# EAGLE board design (EAGLE 7.7.0), part 1 of 3
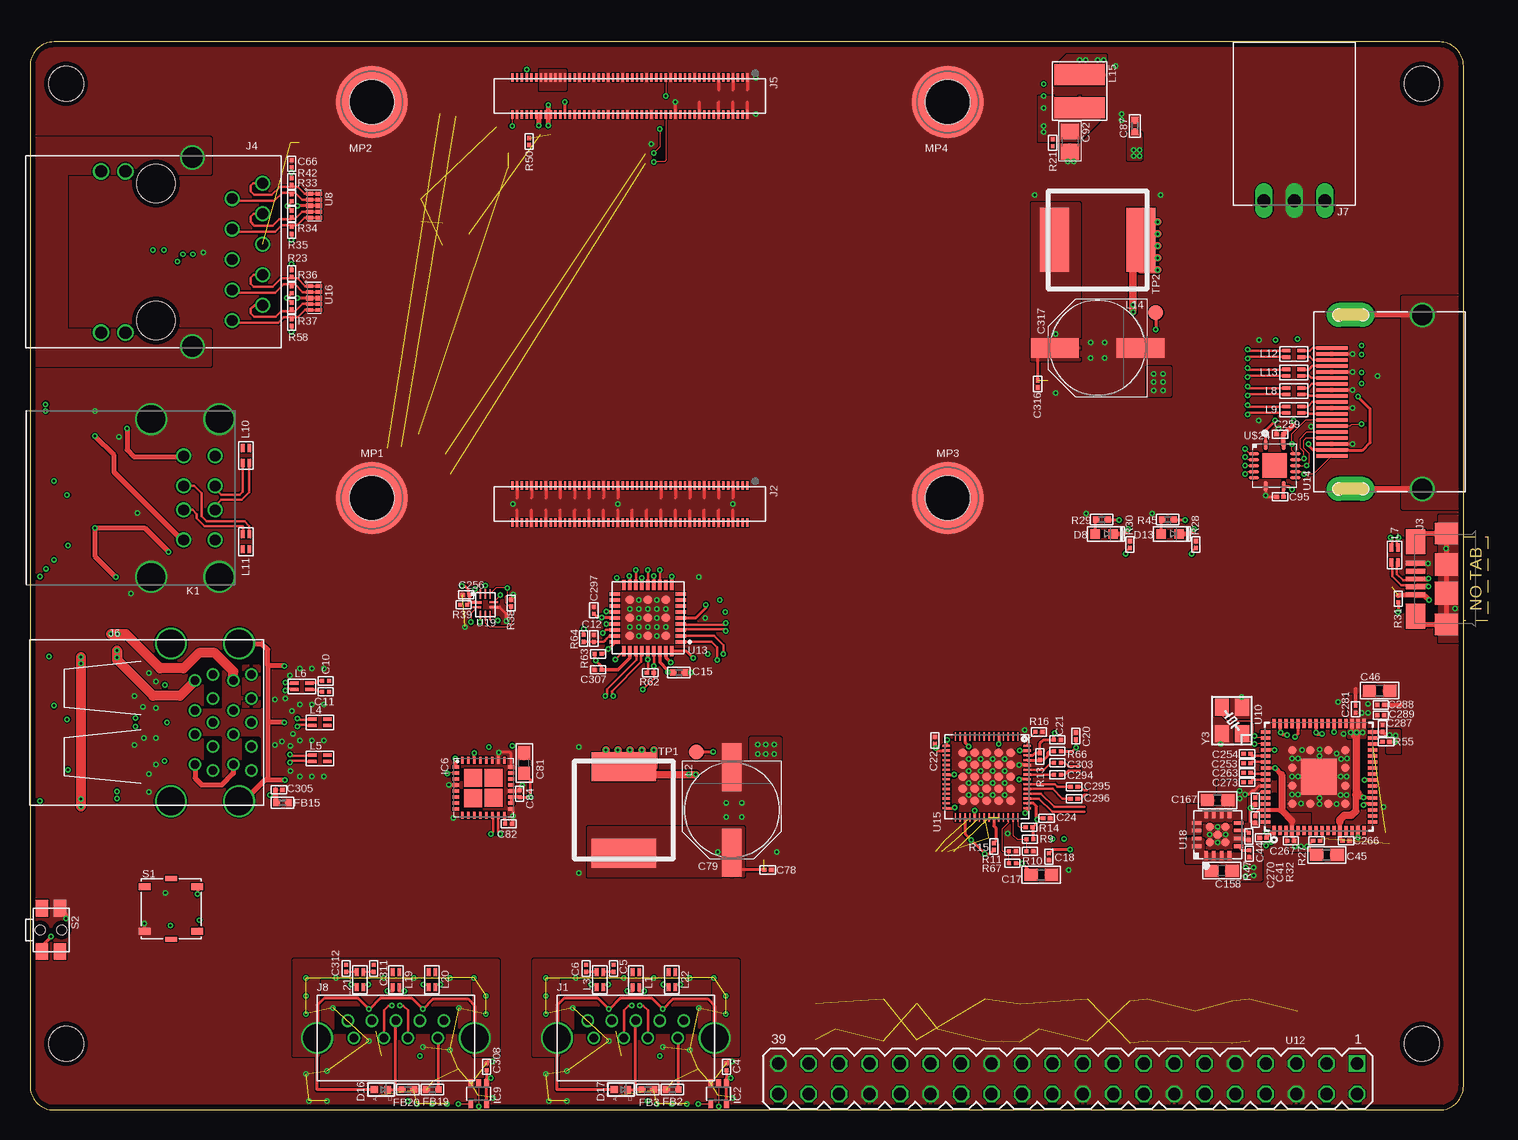
[diagram p24: board, top side]
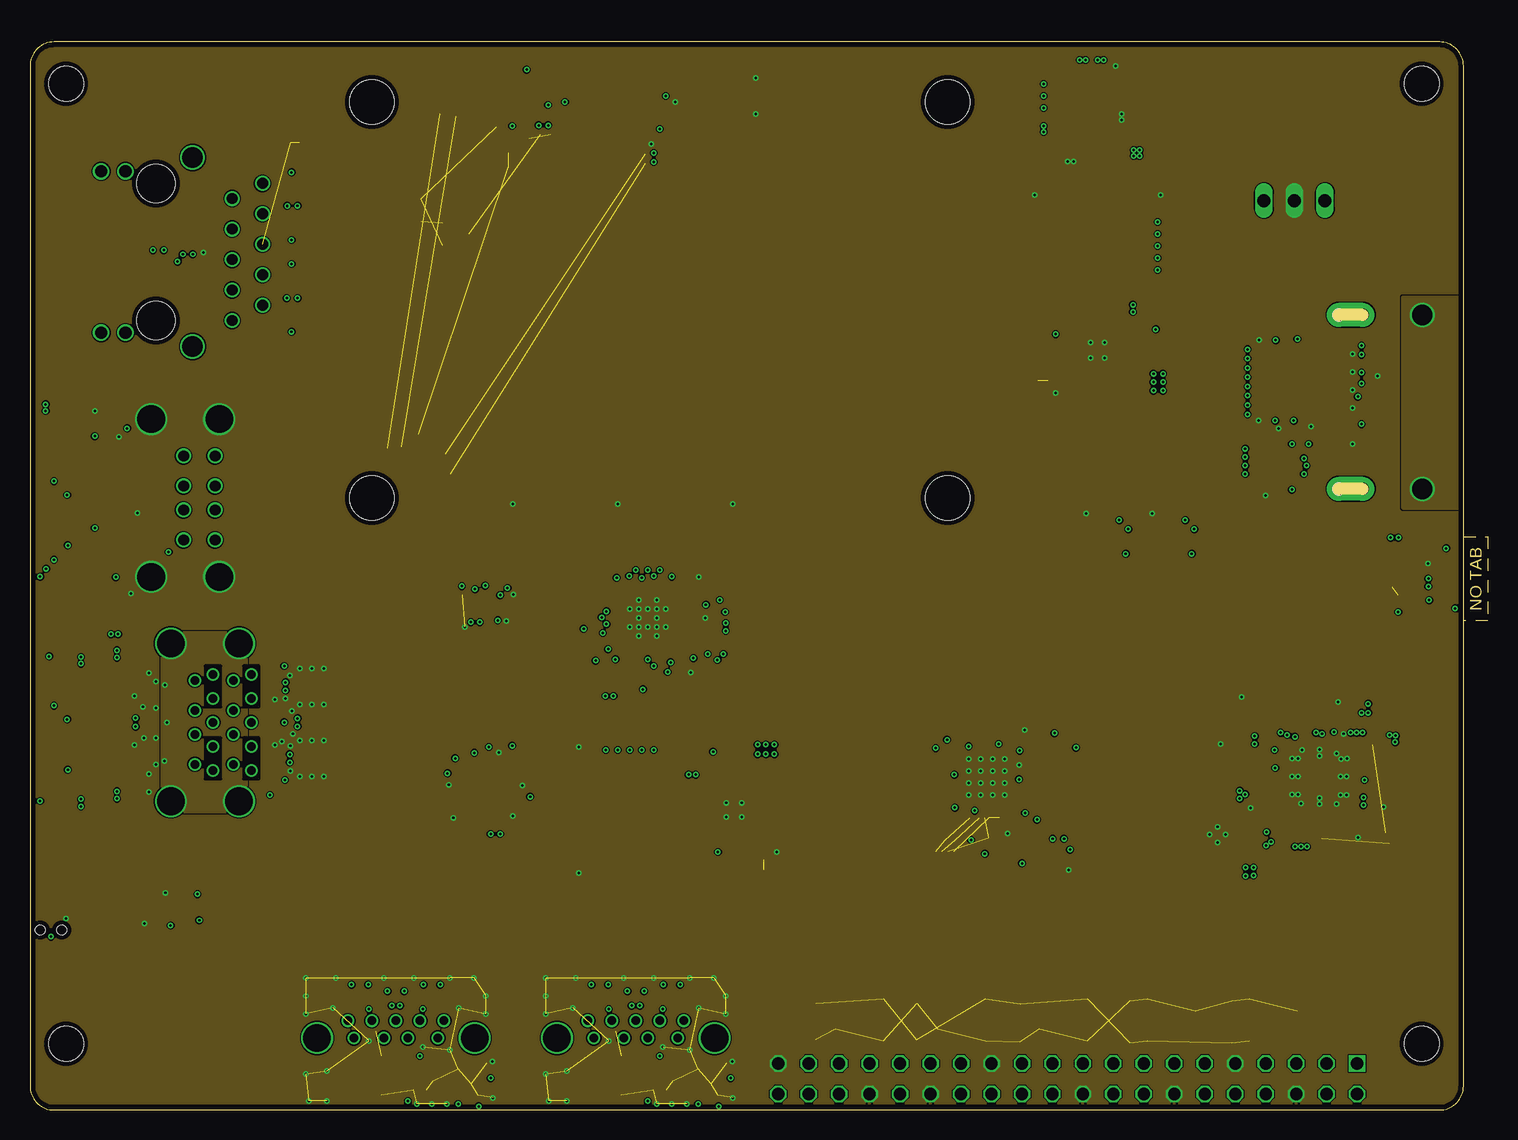
[diagram p25: board, inner layer GND]
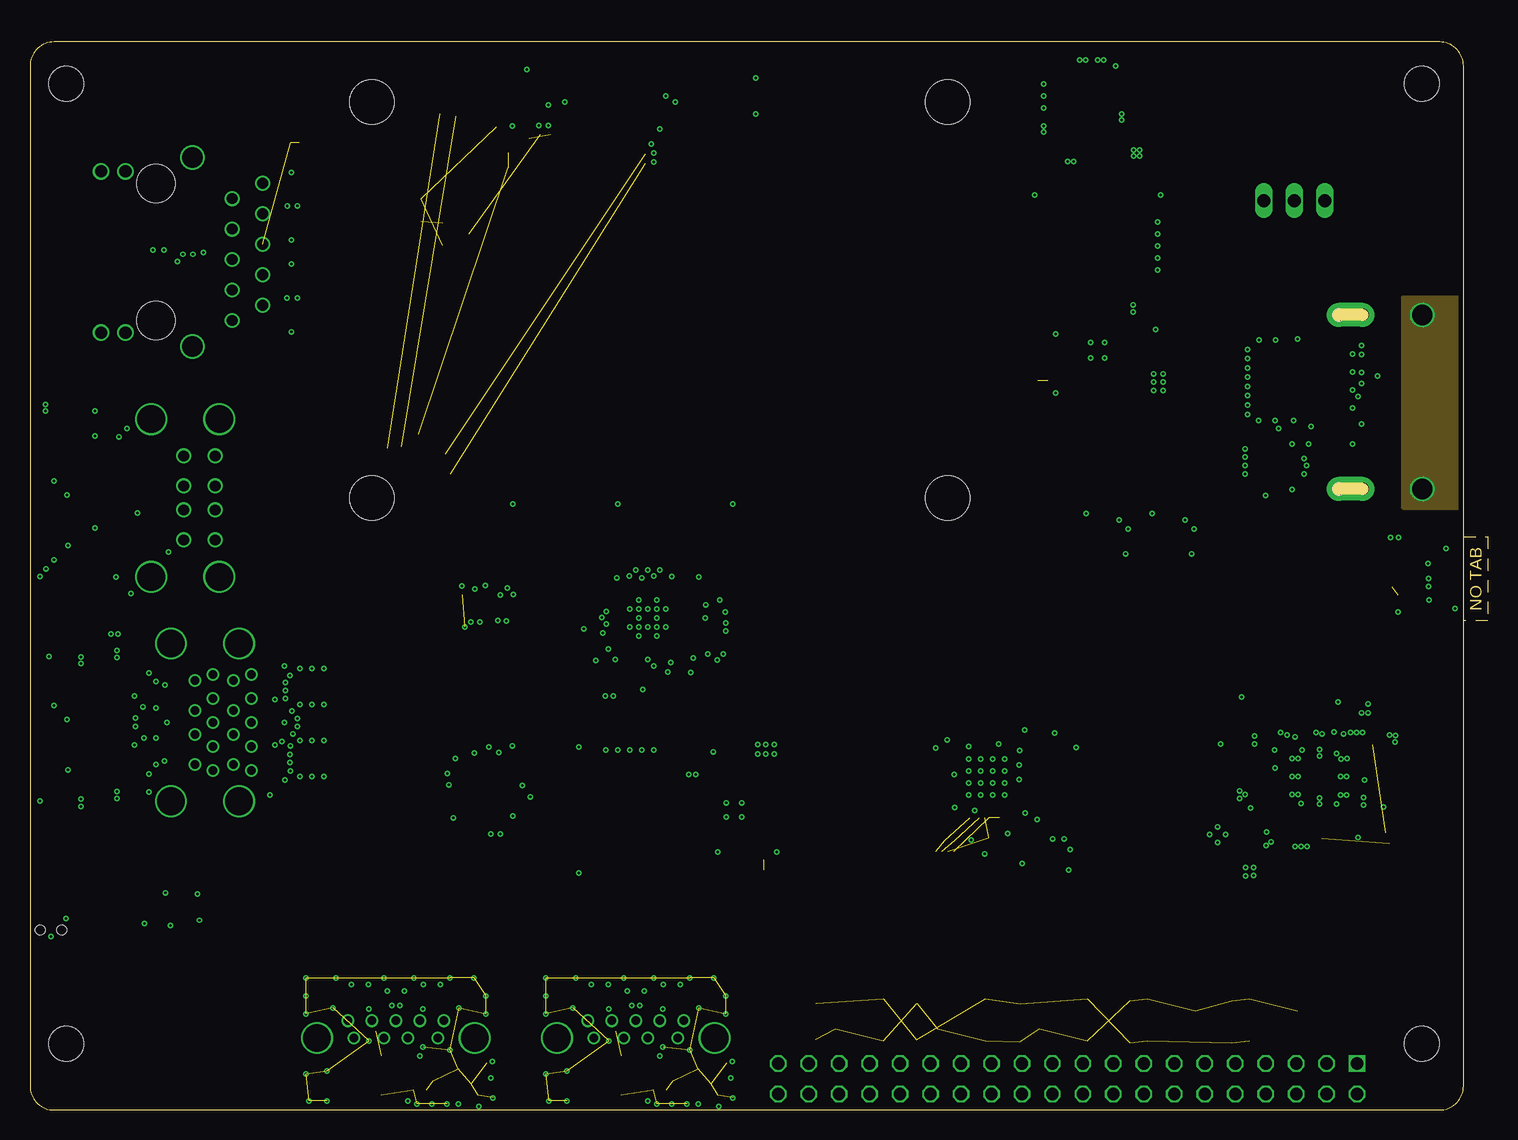
[diagram p26: board, inner layer S3]
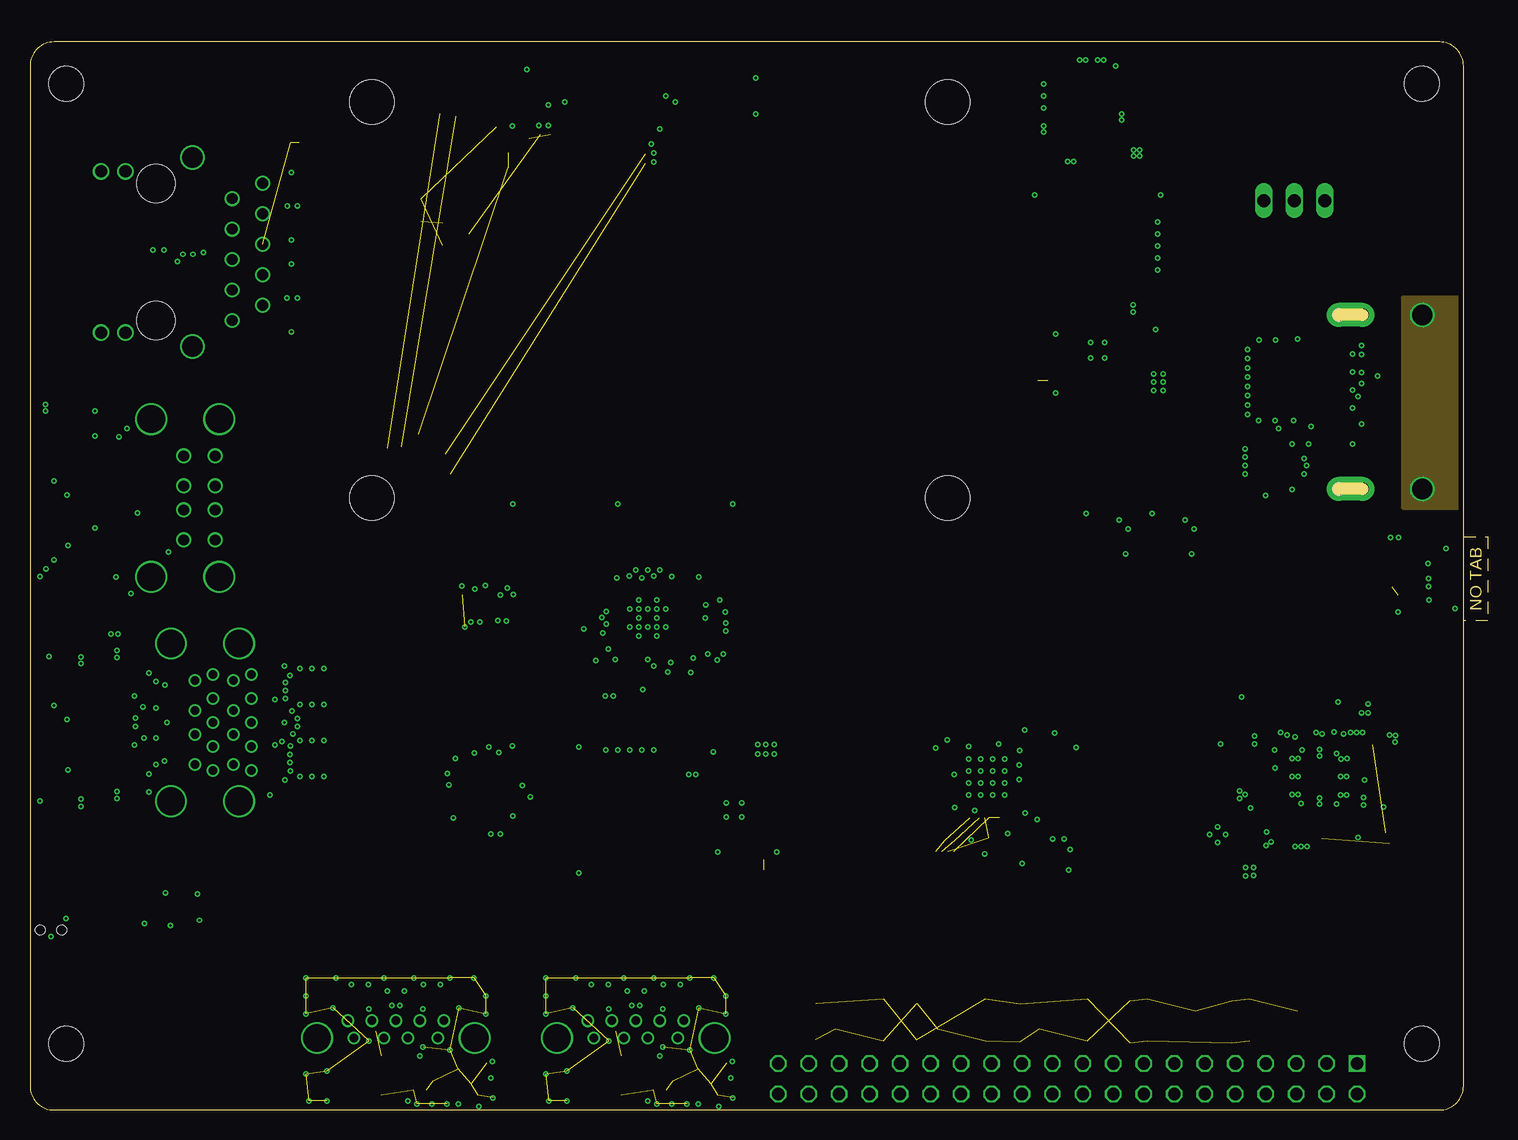
[diagram p27: board, inner layer S14]
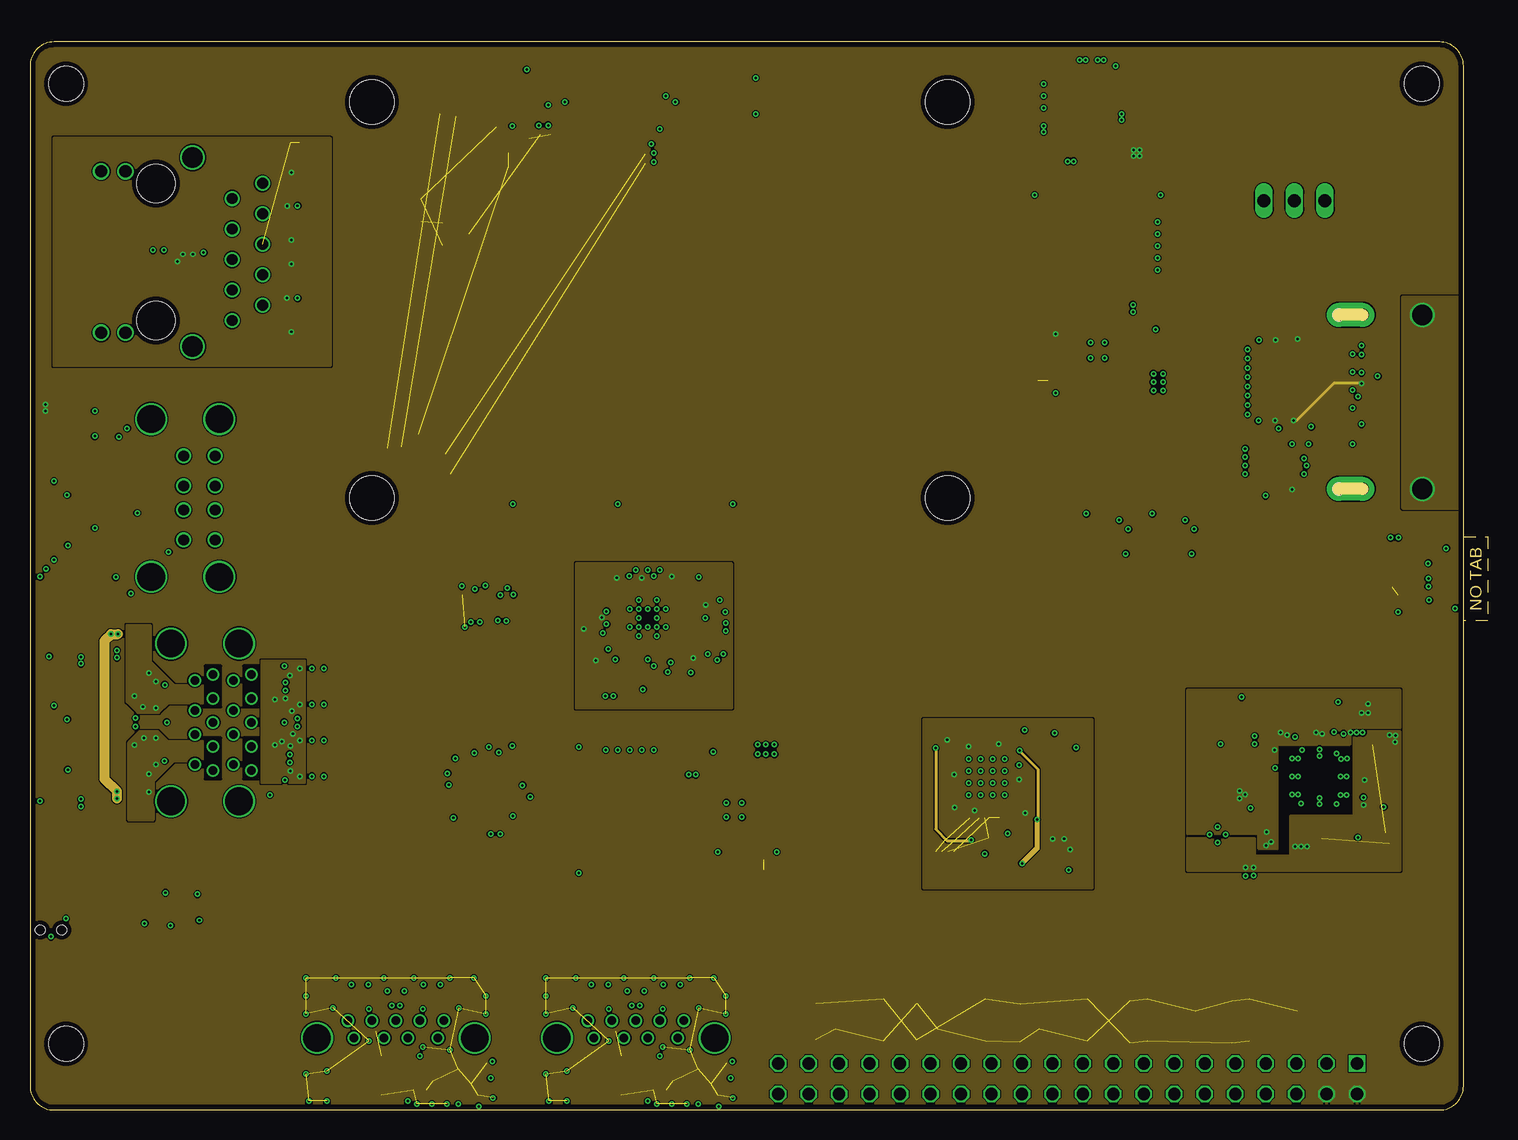
[diagram p28: board, inner layer Power]
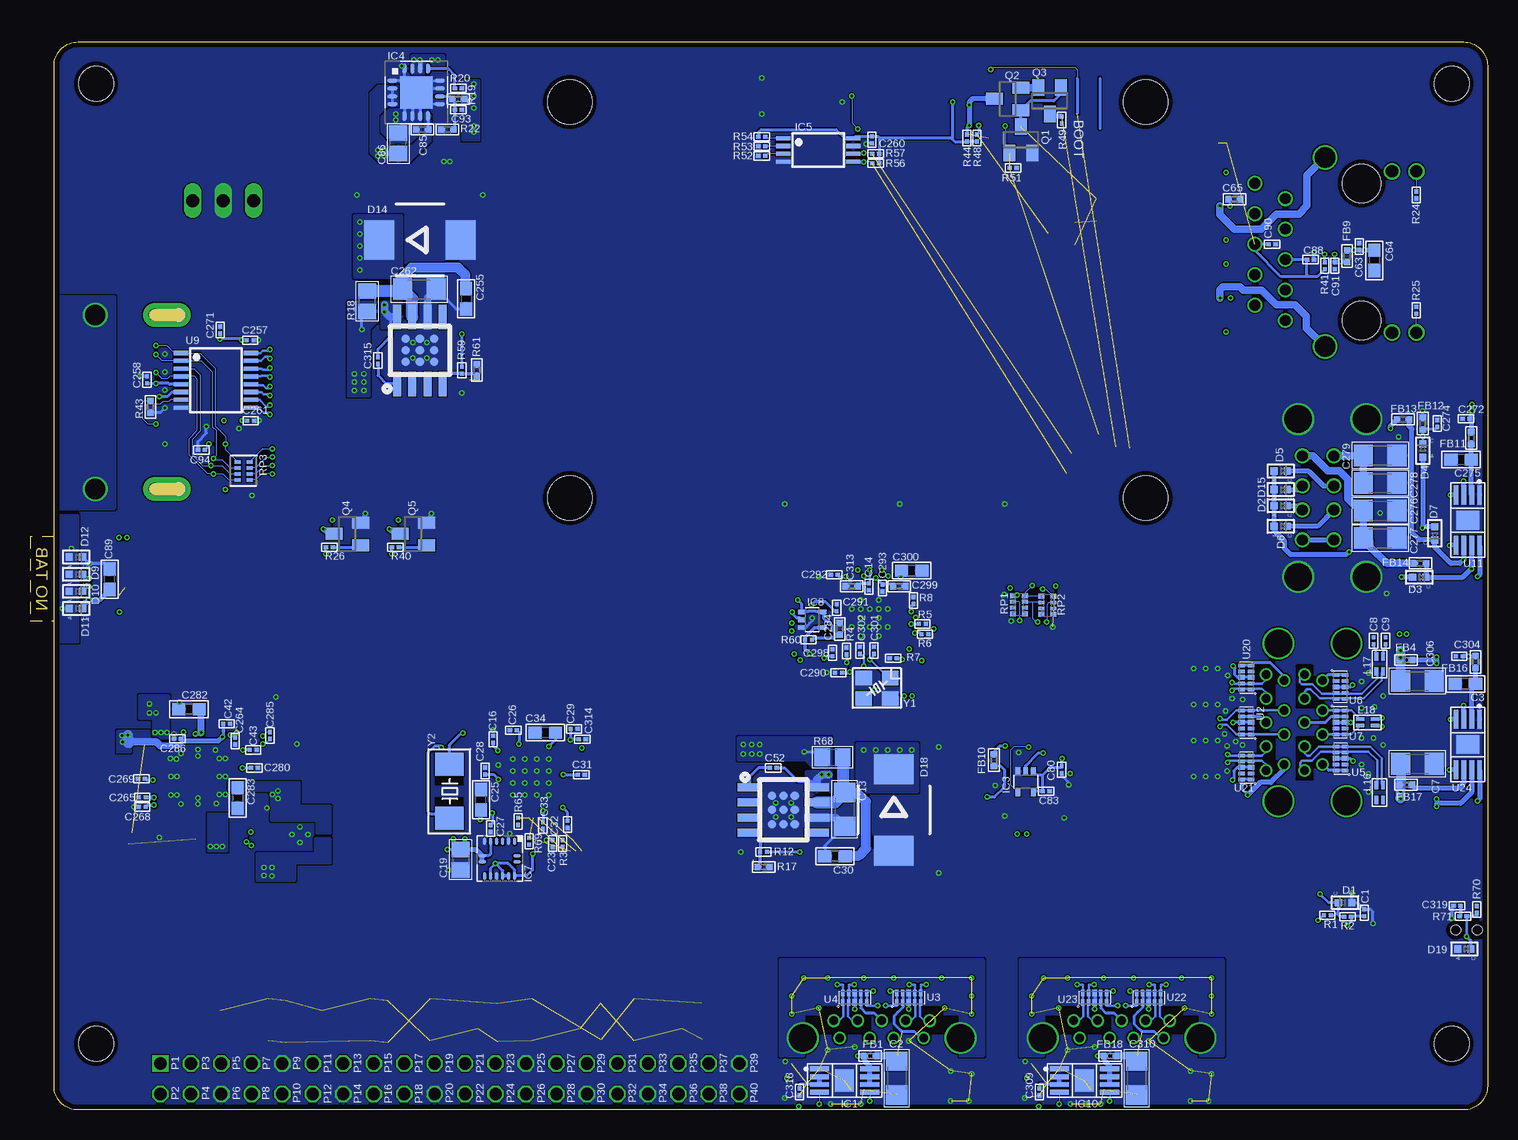
[diagram p29: board, bottom side, seen from below]

Size 121.5 x 89 mm. Coordinates in mm from the lower left corner, seen from the top.
Outline: 119.5,47.75 121.5,47.75 121.5,40.75 119.5,40.75
Outline: 2,0 117.5,0 arc90 119.5,2 119.5,87 arc90 117.5,89 2,89 arc90 0,87 0,2 arc90 2,0
Copper layers (1+2*3+14*15+16): Top 0.035mm / dielectric 0.2mm / GND 0.035mm / dielectric 0.2mm / S3 0.035mm / dielectric 0.2mm / S14 0.035mm / dielectric 0.2mm / Power 0.035mm / dielectric 0.2mm / Bottom 0.035mm
Design rules "geppetto": minimum track width 4mil, minimum drill 8mil, track to track 4mil, track to pad 0.15mm, pad to pad 0.15mm, via to via 0.15mm, smd to smd 0mil, copper to edge 15mil, drill to drill 10mil, minimum pad ring 7mil, minimum via ring 5mil, stop-mask expansion 3mil, vias tented up to drill 20mil, thermal gap 0mil
Net classes: 1 supply: width 0.254 mm; 2 analog: width 0.178 mm; 5 USB: width 0.2 mm, clearance 0.2 mm; 6 HDMI: width 0.2 mm, clearance 0.3 mm; 7 50_OHM: width 0.378 mm, clearance 0.3 mm; 4 xxwide: width 0.203 mm
vRestrict: area 84.5,79 to 94,88.5

## Footprints (pad centres in the part's own frame; a part is rotated, then mirrored left to right if it is on the bottom)
0201 = smd 0.356 x 0.33: 1 -0.292,0; 2 0.292,0
1206 = smd 1.6 x 1.8: 1 -1.4,0; 2 1.4,0
0603 = smd 1.1 x 1: 1 -0.85,0; 2 0.85,0
0402 = smd 0.559 x 0.559: 1 -0.483,0; 2 0.483,0
0805 = smd 1.3 x 1.5: 1 -0.85,0; 2 0.85,0
PANASONIC_F = smd 4 x 1.6: + 3.55,0; - -3.55,0
D0402 = smd 0.6 x 0.6: P1 0,-0.55; P2 0,0.55
D0603 = smd 0.8 x 0.8: A -0.75,0; C 0.75,0
DO-214AB = smd 2.5 x 3.3: A 3.4,0; C -3.4,0
MSOP8-PAD = smd 0.4 x 1.6: 1 -0.975,-2.1; 2 -0.325,-2.1; 3 0.325,-2.1; 4 0.975,-2.1; 5 0.975,2.1; 6 0.325,2.1; 7 -0.325,2.1; 8 -0.975,2.1 | smd 1.89 x 1.57: TP 0,0
SC70-5 = smd 0.4 x 0.7: 1 -0.65,-0.85; 2 0,-0.85; 3 0.65,-0.85; 4 0.65,0.85; 5 -0.65,0.85
PQFP16 = smd 0.85 x 0.35: 1 -1.975,0.975; 2 -1.975,0.325; 3 -1.975,-0.325; 4 -1.975,-0.975; 9 1.975,-0.975; 10 1.975,-0.325; 11 1.975,0.325; 12 1.975,0.975 | smd 0.35 x 0.85: 5 -0.975,-1.975; 6 -0.325,-1.975; 7 0.325,-1.975; 8 0.975,-1.975; 13 0.975,1.975; 14 0.325,1.975; 15 -0.325,1.975; 16 -0.975,1.975 | smd 2.7 x 2.7: P$1 0,0
TSSOP8 = smd 0.35 x 1.2: 1 -0.975,-2.925; 2 -0.325,-2.925; 3 0.325,-2.925; 4 0.975,-2.925; 5 0.975,2.925; 6 0.325,2.925; 7 -0.325,2.925; 8 -0.975,2.925
QFN32 = smd 0.6 x 0.3: 1 -2.3,1.75; 2 -2.3,1.25; 3 -2.3,0.75; 4 -2.3,0.25; 5 -2.3,-0.25; 6 -2.3,-0.75; 7 -2.3,-1.25; 8 -2.3,-1.75; 17 2.3,-1.75; 18 2.3,-1.25; 19 2.3,-0.75; 20 2.3,-0.25; 21 2.3,0.25; 22 2.3,0.75; 23 2.3,1.25; 24 2.3,1.75 | smd 0.3 x 0.6: 9 -1.75,-2.3; 10 -1.25,-2.3; 11 -0.75,-2.3; 12 -0.25,-2.3; 13 0.25,-2.3; 14 0.75,-2.3; 15 1.25,-2.3; 16 1.75,-2.3; 25 1.75,2.3; 26 1.25,2.3; 27 0.75,2.3; 28 0.25,2.3; 29 -0.25,2.3; 30 -0.75,2.3; 31 -1.25,2.3; 32 -1.75,2.3 | smd 1.5 x 1.5: EXP1 -0.85,0.85; EXP2 0.85,0.85; EXP3 -0.85,-0.86; EXP4 0.85,-0.85
EP-3X3MMQFN16 = smd 0.65 x 0.3: 1 -1.45,1.25; 2 -1.45,0.75; 3 -1.45,0.25; 4 -1.45,-0.25; 5 -1.45,-0.75; 6 -1.45,-1.25; 9 1.45,-1.25; 10 1.45,-0.75; 11 1.45,-0.25; 12 1.45,0.25; 13 1.45,0.75; 14 1.45,1.25 | smd 0.3 x 0.65: 7 -0.25,-1.45; 8 0.25,-1.45; 15 0.25,1.45; 16 -0.25,1.45
USB3-A-H-VERT = drill 0.7 round: D+ 0,-1; D- 0,1; DRAIN 1.44,0; GND 0,-3.5; SSRX+ 1.44,-2; SSRX- 1.44,-4; SSTX+ 1.44,4; SSTX- 1.44,2; VBUS 0,3.5 | drill 2.3 round: SH1 0,6.57; SH2 0,-6.57
HRS_DF40C-100DS-0.4V(51) = smd 0.2 x 0.7: 1 -9.8,-1.54; 2 -9.8,1.54; 3 -9.4,-1.54; 4 -9.4,1.54; 5 -9,-1.54; 6 -9,1.54; 7 -8.6,-1.54; 8 -8.6,1.54; 9 -8.2,-1.54; 10 -8.2,1.54; 11 -7.8,-1.54; 12 -7.8,1.54; 13 -7.4,-1.54; 14 -7.4,1.54; 15 -7,-1.54; 16 -7,1.54; 17 -6.6,-1.54; 18 -6.6,1.54; 19 -6.2,-1.54; 20 -6.2,1.54; 21 -5.8,-1.54; 22 -5.8,1.54; 23 -5.4,-1.54; 24 -5.4,1.54; 25 -5,-1.54; 26 -5,1.54; 27 -4.6,-1.54; 28 -4.6,1.54; 29 -4.2,-1.54; 30 -4.2,1.54; 31 -3.8,-1.54; 32 -3.8,1.54; 33 -3.4,-1.54; 34 -3.4,1.54; 35 -3,-1.54; 36 -3,1.54; 37 -2.6,-1.54; 38 -2.6,1.54; 39 -2.2,-1.54; 40 -2.2,1.54; 41 -1.8,-1.54; 42 -1.8,1.54; 43 -1.4,-1.54; 44 -1.4,1.54; 45 -1,-1.54; 46 -1,1.54; 47 -0.6,-1.54; 48 -0.6,1.54; 49 -0.2,-1.54; 50 -0.2,1.54; 51 0.2,-1.54; 52 0.2,1.54; 53 0.6,-1.54; 54 0.6,1.54; 55 1,-1.54; 56 1,1.54; 57 1.4,-1.54; 58 1.4,1.54; 59 1.8,-1.54; 60 1.8,1.54; 61 2.2,-1.54; 62 2.2,1.54; 63 2.6,-1.54; 64 2.6,1.54; 65 3,-1.54; 66 3,1.54; 67 3.4,-1.54; 68 3.4,1.54; 69 3.8,-1.54; 70 3.8,1.54; 71 4.2,-1.54; 72 4.2,1.54; 73 4.6,-1.54; 74 4.6,1.54; 75 5,-1.54; 76 5,1.54; 77 5.4,-1.54; 78 5.4,1.54; 79 5.8,-1.54; 80 5.8,1.54; 81 6.2,-1.54; 82 6.2,1.54; 83 6.6,-1.54; 84 6.6,1.54; 85 7,-1.54; 86 7,1.54; 87 7.4,-1.54; 88 7.4,1.54; 89 7.8,-1.54; 90 7.8,1.54; 91 8.2,-1.54; 92 8.2,1.54; 93 8.6,-1.54; 94 8.6,1.54; 95 9,-1.54; 96 9,1.54; 97 9.4,-1.54; 98 9.4,1.54; 99 9.8,-1.54; 100 9.8,1.54
USB_MICRO_B = smd 2.1 x 1.6: COMMON_SHEILD1 -3.1,4; COMMON_SHEILD2 3.1,4 | smd 1.8 x 1.9: COMMON_SHEILD3 -3.8,1.45; COMMON_SHEILD6 3.8,1.45 | smd 1.9 x 1.9: COMMON_SHEILD4 -1.2,1.45; COMMON_SHEILD5 1.2,1.45 | smd 0.4 x 1.6: P1 -1.3,4; P2 -0.65,4; P3 0,4; P4 0.65,4; P5 1.3,4
7499111447 = drill 0.89 round: 1 5.72,-8.89; 2 4.45,-6.35; 3 3.18,-8.89; 4 1.91,-6.35; 5 0.64,-8.89; 6 -0.63,-6.35; 7 -1.9,-8.89; 8 -3.17,-6.35; 9 -4.44,-8.89; 10 -5.71,-6.35 | drill 1.02 round: 11 6.725,2.54; 12 6.725,4.57; 13 -6.725,2.54; 14 -6.725,4.57 | drill 1.7 round: 15 -7.875,-3.05; 16 7.875,-3.05 | hole 3.2: 5.715,0; -5.715,0
USB3-A-H-DUAL = drill 0.7 round: 1 2,3.5; 2 2,1; 3 2,-1; 4 2,-3.5; 5 3.5,-4; 6 3.5,-2; 7 3.5,0; 8 3.5,2; 9 3.5,4; 10 5.2,3.5; 11 5.2,1; 12 5.2,-1; 13 5.2,-3.5; 14 6.7,-4; 15 6.7,-2; 16 6.7,0; 17 6.7,2; 18 6.7,4 | drill 2.3 round: S1 0,6.57; S2 0,-6.57; S3 5.68,6.57; S4 5.68,-6.57
1X03_90_TH_SHROUD = drill 1.09 long: 1 -2.54,-6.415; 2 0,-6.415; 3 2.54,-6.415
61400826021 = drill 2.3 round: 5 -6.57,5.68; 6 -6.57,0; 7 6.57,0; 8 6.57,5.68 | drill 0.9 round: A1 -3.5,5.33; A2 -1,5.33; A3 1,5.33; A4 3.5,5.33; B1 -3.5,2.71; B2 -1,2.71; B3 1,2.71; B4 3.5,2.71
0504-DLP11S = smd 0.7 x 0.3: 1 -0.625,0.275; 2 0.625,0.275; 3 0.625,-0.275; 4 -0.625,-0.275
3232DZ = smd 2.413 x 5.334: 1 -3.619,0; 2 3.619,0
1515 = smd 1.75 x 4.2: 1 -1.375,0; 2 1.375,0
WA-SMSI_9774___151 = smd 6 x 6: 1 0,0 | hole 3.7: 0,0
SOT23 = smd 1 x 1.4: 1 -0.95,-1.1; 2 0.95,-1.1; 3 0,1.1
RP741X083 = smd 0.4 x 0.5: 1 -0.75,-0.5; 4 0.75,-0.5; 5 0.75,0.5; 8 -0.75,0.5 | smd 0.3 x 0.5: 2 -0.25,-0.5; 3 0.25,-0.5; 6 0.25,0.5; 7 -0.25,0.5
741X08 = smd 0.3 x 0.5: 1 -0.75,-0.5; 2 -0.25,-0.5; 3 0.25,-0.5; 4 0.75,-0.5; 5 0.75,0.5; 6 0.25,0.5; 7 -0.25,0.5; 8 -0.75,0.5
EVQ = smd 0.6 x 1: A@1 -1.85,2.2; A@2 -1.85,-2.2; B@1 1.85,2.2; B@2 1.85,-2.2 | smd 0.45 x 1: G@1 -2.525,0; G@2 2.525,0
EVQP-4 = smd 1.4 x 1.05: A@1 -1.8,0.75; A@2 1.8,0.75; B@1 -1.8,-0.75; B@2 1.8,-0.75 | hole 0.8: 0,0.9; 0,-0.9
TP0500 = smd 1.27 x 1.27: 1 0,0
8SO_POWERPAD = smd 2.05 x 0.66: 1 -2.79,1.905; 2 -2.79,0.635; 3 -2.79,-0.635; 4 -2.79,-1.905; 5 2.79,-1.905; 6 2.79,-0.635; 7 2.79,0.635; 8 2.79,1.905 | smd 0.7 x 0.7: 9 0,0; PWRPAD1 -0.95,1.2; PWRPAD2 0,1.2; PWRPAD3 0.95,1.2; PWRPAD4 -0.95,0; PWRPAD5 0.95,0; PWRPAD6 -0.95,-1.2; PWRPAD7 0,-1.2; PWRPAD8 0.95,-1.2
UFDFN-10 = smd 0.3 x 0.55: 1 -1,-0.385; 2 -0.5,-0.385; 4 0.5,-0.385; 5 1,-0.385; 6 1,0.385; 7 0.5,0.385; 9 -0.5,0.385; 10 -1,0.385 | smd 0.4 x 0.55: 3 0,-0.385; 8 0,0.385
TSSOP16 = smd 1.2 x 0.35: 1 -2.925,2.275; 2 -2.925,1.625; 3 -2.925,0.975; 4 -2.925,0.325; 5 -2.925,-0.325; 6 -2.925,-0.975; 7 -2.925,-1.625; 8 -2.925,-2.275; 9 2.925,-2.275; 10 2.925,-1.625; 11 2.925,-0.975; 12 2.925,-0.325; 13 2.925,0.325; 14 2.925,0.975; 15 2.925,1.625; 16 2.925,2.275
QFN64-9X9MM-FT2232HQ = smd 0.8 x 0.3: 1 -4.45,3.75; 2 -4.45,3.25; 3 -4.45,2.75; 4 -4.45,2.25; 5 -4.45,1.75; 6 -4.45,1.25; 7 -4.45,0.75; 8 -4.45,0.25; 9 -4.45,-0.25; 10 -4.45,-0.75; 11 -4.45,-1.25; 12 -4.45,-1.75; 13 -4.45,-2.25; 14 -4.45,-2.75; 15 -4.45,-3.25; 16 -4.45,-3.75; 33 4.45,-3.75; 34 4.45,-3.25; 35 4.45,-2.75; 36 4.45,-2.25; 37 4.45,-1.75; 38 4.45,-1.25; 39 4.45,-0.75; 40 4.45,-0.25; 41 4.45,0.25; 42 4.45,0.75; 43 4.45,1.25; 44 4.45,1.75; 45 4.45,2.25; 46 4.45,2.75; 47 4.45,3.25; 48 4.45,3.75 | smd 0.3 x 0.8: 17 -3.75,-4.45; 18 -3.25,-4.45; 19 -2.75,-4.45; 20 -2.25,-4.45; 21 -1.75,-4.45; 22 -1.25,-4.45; 23 -0.75,-4.45; 24 -0.25,-4.45; 25 0.25,-4.45; 26 0.75,-4.45; 27 1.25,-4.45; 28 1.75,-4.45; 29 2.25,-4.45; 30 2.75,-4.45; 31 3.25,-4.45; 32 3.75,-4.45; 49 3.75,4.45; 50 3.25,4.45; 51 2.75,4.45; 52 2.25,4.45; 53 1.75,4.45; 54 1.25,4.45; 55 0.75,4.45; 56 0.25,4.45; 57 -0.25,4.45; 58 -0.75,4.45; 59 -1.25,4.45; 60 -1.75,4.45; 61 -2.25,4.45; 62 -2.75,4.45; 63 -3.25,4.45; 64 -3.75,4.45 | smd 3 x 3: 65 0,0 | smd 0.7 x 0.7: EPAD1 -2.22,2.21; EPAD2 -0.72,2.21; EPAD3 0.78,2.21; EPAD4 2.22,2.21; EPAD5 -2.22,0.71; EPAD6 -2.22,-0.79; EPAD7 -2.22,-2.21; EPAD8 -0.72,-2.21; EPAD9 0.78,-2.21; EPAD10 2.22,-2.21; EPAD11 2.22,-0.79; EPAD12 2.22,0.71
2X20 = drill 1.016 square: 1 24.13,1.27 | drill 1.016 octagon: 2 24.13,-1.27; 3 21.59,1.27; 4 21.59,-1.27; 5 19.05,1.27; 6 19.05,-1.27; 7 16.51,1.27; 8 16.51,-1.27; 9 13.97,1.27; 10 13.97,-1.27; 11 11.43,1.27; 12 11.43,-1.27; 13 8.89,1.27; 14 8.89,-1.27; 15 6.35,1.27; 16 6.35,-1.27; 17 3.81,1.27; 18 3.81,-1.27; 19 1.27,1.27; 20 1.27,-1.27; 21 -1.27,1.27; 22 -1.27,-1.27; 23 -3.81,1.27; 24 -3.81,-1.27; 25 -6.35,1.27; 26 -6.35,-1.27; 27 -8.89,1.27; 28 -8.89,-1.27; 29 -11.43,1.27; 30 -11.43,-1.27; 31 -13.97,1.27; 32 -13.97,-1.27; 33 -16.51,1.27; 34 -16.51,-1.27; 35 -19.05,1.27; 36 -19.05,-1.27; 37 -21.59,1.27; 38 -21.59,-1.27; 39 -24.13,1.27; 40 -24.13,-1.27
QFN36-6X6MM = smd 0.9 x 0.28: 1 -2.75,2; 2 -2.75,1.5; 3 -2.75,1; 4 -2.75,0.5; 5 -2.75,0; 6 -2.75,-0.5; 7 -2.75,-1; 8 -2.75,-1.5; 9 -2.75,-2; 19 2.75,-2; 20 2.75,-1.5; 21 2.75,-1; 22 2.75,-0.5; 23 2.75,0; 24 2.75,0.5; 25 2.75,1; 26 2.75,1.5; 27 2.75,2 | smd 0.28 x 0.9: 10 -2,-2.75; 11 -1.5,-2.75; 12 -1,-2.75; 13 -0.5,-2.75; 14 0,-2.75; 15 0.5,-2.75; 16 1,-2.75; 17 1.5,-2.75; 18 2,-2.75; 28 2,2.75; 29 1.5,2.75; 30 1,2.75; 31 0.5,2.75; 32 0,2.75; 33 -0.5,2.75; 34 -1,2.75; 35 -1.5,2.75; 36 -2,2.75 | smd 0.7 x 0.7: EPAD 0,0; EXP1 1.5,0; EXP2 -1.5,0; EXP3 0,1.5; EXP4 0,-1.5; EXP5 1.5,-1.5; EXP6 -1.5,-1.5; EXP7 -1.5,1.5; EXP8 1.5,1.5
47151-001 = smd 0.3 x 2.6: 1 4.5,1.56; 2 4,1.56; 3 3.5,1.56; 4 3,1.56; 5 2.5,1.56; 6 2,1.56; 7 1.5,1.56; 8 1,1.56; 9 0.5,1.56; 10 0,1.56; 11 -0.5,1.56; 12 -1,1.56; 13 -1.5,1.56; 14 -2,1.56; 15 -2.5,1.56; 16 -3,1.56; 17 -3.5,1.56; 18 -4,1.56; 19 -4.5,1.56 | drill 1.7 round: G1 -7.25,-5.96; G2 7.25,-5.96 | drill 1 pad 2 offset: G3 7.25,-1; G4 -7.25,-1 | hole 1: -7.25,1; 7.25,1
VQFN56 = smd 0.75 x 0.2: 1 -3.38,2.6; 2 -3.38,2.2; 3 -3.38,1.8; 4 -3.38,1.4; 5 -3.38,1; 6 -3.38,0.6; 7 -3.38,0.2; 8 -3.38,-0.2; 9 -3.38,-0.6; 10 -3.38,-1; 11 -3.38,-1.4; 12 -3.38,-1.8; 13 -3.38,-2.2; 14 -3.38,-2.6; 29 3.38,-2.6; 30 3.38,-2.2; 31 3.38,-1.8; 32 3.38,-1.4; 33 3.38,-1; 34 3.38,-0.6; 35 3.38,-0.2; 36 3.38,0.2; 37 3.38,0.6; 38 3.38,1; 39 3.38,1.4; 40 3.38,1.8; 41 3.38,2.2; 42 3.38,2.6 | smd 0.2 x 0.75: 15 -2.6,-3.38; 16 -2.2,-3.38; 17 -1.8,-3.38; 18 -1.4,-3.38; 19 -1,-3.38; 20 -0.6,-3.38; 21 -0.2,-3.38; 22 0.2,-3.38; 23 0.6,-3.38; 24 1,-3.38; 25 1.4,-3.38; 26 1.8,-3.38; 27 2.2,-3.38; 28 2.6,-3.38; 43 2.6,3.38; 44 2.2,3.38; 45 1.8,3.38; 46 1.4,3.38; 47 1,3.38; 48 0.6,3.38; 49 0.2,3.38; 50 -0.2,3.38; 51 -0.6,3.38; 52 -1,3.38; 53 -1.4,3.38; 54 -1.8,3.38; 55 -2.2,3.38; 56 -2.6,3.38 | smd 0.7 x 0.7: P$1 -2,2; P$2 -1,2; P$3 0,2; P$4 1,2; P$5 2,2; P$6 -2,1; P$7 -1,1; P$8 0,1; P$9 1,1; P$10 2,1; P$11 -2,0; P$12 -1,0; P$13 0,0; P$14 1,0; P$15 2,0; P$16 -2,-1; P$17 -1,-1; P$18 0,-1; P$19 1,-1; P$20 2,-1; P$21 -2,-2; P$22 -1,-2; P$23 0,-2; P$24 1,-2; P$25 2,-2
LFCSPWQ16 = smd 0.8 x 0.3: 1 -1.75,0.975; 2 -1.75,0.325; 3 -1.75,-0.325; 4 -1.75,-0.975; 9 1.75,-0.975; 10 1.75,-0.325; 11 1.75,0.325; 12 1.75,0.975 | smd 0.3 x 0.8: 5 -0.975,-1.75; 6 -0.325,-1.75; 7 0.325,-1.75; 8 0.975,-1.75; 13 0.975,1.75; 14 0.325,1.75; 15 -0.325,1.75; 16 -0.975,1.75 | smd 0.7 x 0.7: EP 0,0; EP1 -0.64,0.64; EP2 0.64,0.64; EP3 -0.64,-0.64; EP4 0.64,-0.64
UQFN-10 = smd 0.2 x 0.8: 1 -0.2,-0.7; 2 0.2,-0.7; 6 0.2,0.7; 7 -0.2,0.7 | smd 0.8 x 0.2: 3 0.9,-0.4; 4 0.9,0; 5 0.9,0.4; 8 -0.9,0.4; 9 -0.9,0; 10 -0.9,-0.4
GEPPETTO_HOLE_2.9 = hole 2.9: 0,0
S-PVQFN-N14 = smd 0.85 x 0.28: 1 -1.725,-0.75; 7 1.725,-0.75; 8 1.725,0.75; 14 -1.725,0.75 | smd 0.28 x 0.85: 2 -1,-1.725; 3 -0.5,-1.725; 4 0,-1.725; 5 0.5,-1.725; 6 1,-1.725; 9 1,1.725; 10 0.5,1.725; 11 0,1.725; 12 -0.5,1.725; 13 -1,1.725 | smd 2.05 x 2.05: PAD 0,0
CRYSTAL-3225 = smd 1.4 x 1.2: 1 -1.1,-0.85; 2 1.1,-0.85; 3 1.1,0.85; 4 -1.1,0.85
CS10 = smd 1.9 x 2.4: 1 -2.25,0; 2 2.25,0

## Placement (x,y rotation side)
C1  GRM0335C1E470JA01D  [0201]  10.27,16.44 90 bottom
C2  GRM31CR60J227ME11L  [1206]  49.25,2.65 270 bottom
C3  C1608X5R1A106M080AC  [0603]  1.85,35.5 180 bottom
C4  GRM033R60J104KE19D  [0201]  58.05,3.6 90 top
C5  GRM033R60J104KE19D  [0201]  48.65,11.8 270 top
C6  GRM033R60J104KE19D  [0201]  46.35,11.8 270 top
C7  GRM31CR60J227ME11L  [1206]  5.85,28.85 0 bottom
C8  GRM033R60J104KE19D  [0201]  9.5,39.1 270 bottom
C9  GRM033R60J104KE19D  [0201]  8.5,39.1 270 bottom
C10  GRM033R60J104KE19D  [0201]  24.65,35.75 180 top
C11  GRM033R60J104KE19D  [0201]  24.65,34.85 180 top
C12  GRM033R60J104KE19D  [0201]  47,39.3 90 top
C13  CL31A106KBHNNNE  [1206]  53.6,25.05 270 bottom
C14  GRM033R60J104KE19D  [0201]  51.55,43.6 270 bottom
C15  CL05A105KO5NNNC  [0402]  54.1,36.45 0 top
C16  GRM033R60J104KE19D  [0201]  82.9,30.9 90 bottom
C17  CGB3B1X5R1A475K055AC  [0603]  84.3,19.6 0 top
C18  GRM033R60J104KE19D  [0201]  84.95,21.1 270 top
C19  22uF  [0805]  85.6,20.85 270 bottom
C20  GRM0335C1H220JA01D  [0201]  87.2,31.17 90 top
C21  GRM0335C1H220JA01D  [0201]  85.65,30.85 0 top
C22  GRM033R60J104KE19D  [0201]  75.45,30.8 90 top
C23  GRM033R60J104KE19D  [0201]  77.95,22.2 270 bottom
C24  GRM033R60J104KE19D  [0201]  84.75,24.3 0 top
C25  CGB3B1X5R1A475K055AC  [0603]  83.9,25.85 90 bottom
C26  GRM033R60J104KE19D  [0201]  81.2,31.65 180 bottom
C27  GRM033R60J104KE19D  [0201]  83.1,23.45 270 bottom
C28  GRM033R60J104KE19D  [0201]  83.55,28.25 90 bottom
C29  GRM033R60J104KE19D  [0201]  76.15,31.75 0 bottom
C30  C0603C103K5RACTU  [0603]  54.4,21.15 180 bottom
C31  GRM033R60J104KE19D  [0201]  75.55,27.95 0 bottom
C32  GRM033R60J104KE19D  [0201]  76.7,23.8 270 bottom
C33  GRM033R60J104KE19D  [0201]  78.75,23.7 270 bottom
C34  CGB3B1X5R1A475K055AC  [0603]  78.55,31.45 180 bottom
C41  GRM033R60J104KE19D  [0201]  102.15,24.2 270 top
C42  GRM033R60J104KE19D  [0201]  105.1,32.2 0 bottom
C43  GRM033R60J104KE19D  [0201]  102.9,30 0 bottom
C44  GRM033R60J104KE19D  [0201]  102.8,22.7 180 top
C45  C1608X5R1A106M080AC  [0603]  108.1,21.25 0 top
C46  C1608X5R1A106M080AC  [0603]  112.5,34.95 0 top
C52  GRM033R61C103KA12D  [0201]  59.55,28.5 0 bottom
C63  GRM033R60J104KE19D  [0201]  10.7,71.95 90 bottom
C64  C1608X5R1A106M080AC  [0603]  9.45,70.8 270 bottom
C65  CL05A105KO5NNNC  [0402]  21.1,75.9 0 bottom
C66  GRM033R60J104KE19D  [0201]  21.8,78.85 90 top
C78  GRM033R61C103KA12D  [0201]  61.5,20 0 top
C79  EEE-1EA331UP  [PANASONIC_F]  58.5,25 270 top
C80  GRM033R60J104KE19D  [0201]  35.5,28.35 270 bottom
C81  CGB3B1X5R1A475K055AC  [0603]  41.2,28.9 90 top
C82  GRM033R60J104KE19D  [0201]  39.9,23.85 0 top
C83  GRM033R60J104KE19D  [0201]  36.8,26.55 0 bottom
C84  GRM033R60J104KE19D  [0201]  40.8,26.35 90 top
C85  EMK105B7104KV-F  [0402]  88.8,81.7 180 bottom
C86  EMK212BJ106KG-T  [0805]  90.8,80.55 90 bottom
C87  CL05A105KO5NNNC  [0402]  92.1,82 90 top
C88  GRM033R60J104KE19D  [0201]  14.76,70.87 0 bottom
C89  CGB3B1X5R1A475K055AC  [0603]  114.85,44.23 90 bottom
C90  GRM033R60J104KE19D  [0201]  17.95,72.15 0 bottom
C91  GRM033R60J104KE19D  [0201]  12.74,70.35 270 bottom
C92  22uF  [0805]  86.7,80.7 270 top
C93  UMK063CG100DTF  [0201]  85.8,83.35 180 bottom
C94  GRM033R60J104KE19D  [0201]  107.2,55 180 bottom
C95  GRM033R60J104KE19D  [0201]  104.2,51.1 180 top
C158  CGB3B1X5R1A475K055AC  [0603]  99.35,19.95 180 top
C167  CGB3B1X5R1A475K055AC  [0603]  99,25.8 180 top
C253  GRM033R60J104KE19D  [0201]  101.45,28.9 0 top
C254  GRM033R60J104KE19D  [0201]  101.45,29.7 0 top
C255  C0603C103K5RACTU  [0603]  85.15,67.6 270 bottom
C256  GRM033R60J104KE19D  [0201]  36.35,42.95 180 top
C257  GRM033R61C103KA12D  [0201]  103.15,64.15 0 bottom
C258  GRM033R60J104KE19D  [0201]  111.75,60.85 90 bottom
C259  GRM033R60J104KE19D  [0201]  104.2,56.3 180 top
C260  GRM033R60J104KE19D  [0201]  51.3,80.85 270 bottom
C261  GRM033R61C103KA12D  [0201]  103.1,57.45 0 bottom
C262  CL31A106KBHNNNE  [1206]  89.05,68.4 0 bottom
C263  GRM033R60J104KE19D  [0201]  101.45,28.1 0 top
C264  GRM033R60J104KE19D  [0201]  104.4,30.75 270 bottom
C265  GRM033R60J104KE19D  [0201]  112.15,26.05 180 bottom
C266  GRM033R60J104KE19D  [0201]  109.7,22.45 0 top
C267  GRM033R60J104KE19D  [0201]  105.1,22.45 180 top
C268  GRM033R60J104KE19D  [0201]  112.15,25.25 180 bottom
C269  GRM033R60J104KE19D  [0201]  112.2,27.6 180 bottom
C270  GRM033R71A682KA01D  [0201]  101.6,22.8 270 top
C271  GRM033R60J104KE19D  [0201]  105.65,65 90 bottom
C272  GRM033R60J104KE19D  [0201]  1.8,57.6 180 bottom
C273  GRM033R60J104KE19D  [0201]  101.45,27.3 0 top
C274  GRM033R61C103KA12D  [0201]  4.2,57.2 90 bottom
C275  C1608X5R1A106M080AC  [0603]  2.2,54.2 180 bottom
C276  DNP  [1206]  8.95,49.95 0 bottom
C277  GRM31CR60J227ME11L  [1206]  8.95,47.65 0 bottom
C278  DNP  [1206]  8.95,52.25 0 bottom
C279  GRM31CR60J227ME11L  [1206]  8.95,54.55 0 bottom
C280  GRM033R60J104KE19D  [0201]  102.8,28.5 0 bottom
C281  GRM033R60J104KE19D  [0201]  110.5,33.4 90 top
C282  C1608X5R1C475K080AC  [0603]  108.25,33.4 180 bottom
C283  C1608X5R1C475K080AC  [0603]  104.2,26 270 bottom
C284  DNP  [0402]  54,40.1 90 bottom
C285  UMK063CG100DTF  [0201]  101.5,31.2 270 bottom
C286  GRM033R60J104KE19D  [0201]  109.2,30.95 180 bottom
C287  GRM033R60J104KE19D  [0201]  112.75,31.8 90 top
C288  GRM033R60J104KE19D  [0201]  112.6,33.75 0 top
C289  GRM033R60J104KE19D  [0201]  112.6,32.9 0 top
C290  GRM033R60J104KE19D  [0201]  54.1,36.45 180 bottom
C291  GRM033R60J104KE19D  [0201]  54.25,41.85 90 bottom
C292  GRM033R60J104KE19D  [0201]  54.45,44.6 180 bottom
C293  GRM033R60J104KE19D  [0201]  50.45,43.5 270 bottom
C294  GRM033R60J104KE19D  [0201]  85.65,27.95 180 top
C295  GRM033R60J104KE19D  [0201]  87.05,26.95 180 top
C296  GRM033R60J104KE19D  [0201]  87.05,25.95 180 top
C297  GRM033R60J104KE19D  [0201]  47,41.65 90 top
C298  GRM033R60J104KE19D  [0201]  54.6,38.1 90 bottom
C299  CL05A105KO5NNNC  [0402]  49.05,43.65 0 bottom
C300  CGB3B1X5R1A475K055AC  [0603]  48,44.95 0 bottom
C301  GRM0335C1H220JA01D  [0201]  51.15,38.3 90 bottom
C302  GRM0335C1H220JA01D  [0201]  52.3,38.3 90 bottom
C303  GRM033R60J104KE19D  [0201]  85.65,28.95 180 top
C304  GRM033R60J104KE19D  [0201]  2.35,37.8 180 bottom
C305  GRM033R61C103KA12D  [0201]  20.75,26.7 0 top
C306  GRM31CR60J227ME11L  [1206]  5.85,35.75 0 bottom
C307  GRM033R60J104KE19D  [0201]  47.35,36.7 180 top
C308  GRM033R60J104KE19D  [0201]  38.05,3.6 90 top
C309  GRM033R60J104KE19D  [0201]  37.35,1.5 270 bottom
C310  GRM31CR60J227ME11L  [1206]  29.25,2.65 270 bottom
C311  GRM033R60J104KE19D  [0201]  28.65,11.8 270 top
C312  GRM033R60J104KE19D  [0201]  26.35,11.8 270 top
C313  CL05A105KO5NNNC  [0402]  53,43.65 180 bottom
C314  GRM033R60J104KE19D  [0201]  75.45,30.9 0 bottom
C315  GRM033R61C103KA12D  [0201]  92.5,62.45 90 bottom
C316  GRM033R61C103KA12D  [0201]  84,60.5 270 top
C317  EEE-1EA331UP  [PANASONIC_F]  89,63.5 180 top
C318  GRM033R60J104KE19D  [0201]  57.35,1.5 270 bottom
C319  GRM0335C1E470JA01D  [0201]  2.54,17.03 180 bottom
D1  B72590D0050A060  [D0402]  11.86,17.28 90 bottom
D2  PS04LTVA1  [D0402]  17.25,50.35 270 bottom
D3  B72590D0050A060  [D0402]  5.7,44.4 270 bottom
D4  B72590D0050A060  [D0402]  5.4,54.95 0 bottom
D5  PS04LTVA1  [D0402]  17.25,53.25 270 bottom
D6  PS04LTVA1  [D0402]  17.25,48.65 270 bottom
D7  B72590D0050A060  [D0402]  4.4,48.05 180 bottom
D8  150060GS75000  [D0603]  89.55,48 0 top
D9  PS04LTVA1  [D0402]  117.67,44.63 270 bottom
D10  PS04LTVA1  [D0402]  117.67,43.22 270 bottom
D11  B72590D0050A060  [D0402]  117.67,41.8 270 bottom
D12  B72590D0050A060  [D0402]  117.67,46.08 270 bottom
D13  150060RS75000  [D0603]  95.05,48 0 top
D14  CDBC540-G  [DO-214AB]  89,72.5 0 bottom
D15  PS04LTVA1  [D0402]  17.25,51.7 270 bottom
D16  PS04LTVA1  [D0402]  29.25,1.7 270 top
D17  PS04LTVA1  [D0402]  49.25,1.7 270 top
D18  CDBC540-G  [DO-214AB]  49.5,25 270 bottom
D19  B72590D0050A060  [D0402]  1.94,13.42 270 bottom
FB1  BLM15PX121SN1D  [0402]  51.45,4.5 0 bottom
FB2  BLM15PX121SN1D  [0402]  53.55,1.7 0 top
FB3  BLM15PX121SN1D  [0402]  51.5,1.7 180 top
FB4  BLM15PX121SN1D  [0402]  6.8,37.5 0 bottom
FB9  BLM15PX121SN1D  [0402]  11.7,71.15 90 bottom
FB10  BLM15PX121SN1D  [0402]  41.15,29.15 270 bottom
FB11  BLM15PX121SN1D  [0402]  1.35,56 270 bottom
FB12  BLM15PX121SN1D  [0402]  5.4,57.2 270 bottom
FB13  BLM15PX121SN1D  [0402]  7.05,57.55 0 bottom
FB14  BLM15PX121SN1D  [0402]  5.6,45.55 0 bottom
FB15  BLM15PX121SN1D  [0402]  21.05,25.6 180 top
FB16  BLM15PX121SN1D  [0402]  1,37.35 270 bottom
FB17  BLM15PX121SN1D  [0402]  6.8,27.1 0 bottom
FB18  BLM15PX121SN1D  [0402]  31.45,4.5 0 bottom
FB19  BLM15PX121SN1D  [0402]  33.55,1.7 0 top
FB20  BLM15PX121SN1D  [0402]  31.5,1.7 180 top
IC1  TPS2065CDGNR  [MSOP8-PAD]  53.6,2.45 270 bottom
IC2  SN74LV1T126DCKR  [SC70-5]  57.4,1.35 180 top
IC3  SN74LV1T126DCKR  [SC70-5]  38.5,27.35 180 bottom
IC4  TPS62111RSAT  [PQFP16]  89.3,84.8 0 bottom
IC5  CAT24C256YI-GT3  [TSSOP8]  55.8,80 270 bottom
IC6  FT232RQ-REEL  [QFN32]  37.8,26.85 0 top
IC7  EP5368QI  [EP-3X3MMQFN16]  82.35,20.95 270 bottom
IC8  DNP  [SC70-5]  56.3,40.85 270 bottom
IC9  SN74LV1T126DCKR  [SC70-5]  37.4,1.35 180 top
IC10  TPS2065CDGNR  [MSOP8-PAD]  33.6,2.45 270 bottom
J1  10117836-002LF  [USB3-A-H-VERT]  50.5,6 90 top
J2  DF40C-100DS-0.4V(51)  [HRS_DF40C-100DS-0.4V(51)]  50,50.5 180 top
J3  10118192-0001LF  [USB_MICRO_B]  119.5,44.25 90 top
J4  7499111447  [7499111447]  10.5,71.5 90 top
J5  DF40C-100DS-0.4V(51)  [HRS_DF40C-100DS-0.4V(51)]  50,84.5 180 top
J6  GSB311231HR  [USB3-A-H-DUAL]  11.75,32.3 0 top
J7  70553-0002  [1X03_90_TH_SHROUD]  105.4,82.2 0 top
J8  10117836-002LF  [USB3-A-H-VERT]  30.5,6 90 top
K1  61400826021  [61400826021]  10.1,51 270 top
L1  DLP11SN900HL2L  [0504-DLP11S]  50.5,10.85 90 top
L2  IHLP3232DZER100M11  [3232DZ]  49.5,25 270 top
L3  DLP11SN900HL2L  [0504-DLP11S]  47.5,10.85 90 top
L4  DLP11SN900HL2L  [0504-DLP11S]  24.15,32.3 0 top
L5  DLP11SN900HL2L  [0504-DLP11S]  24.15,29.3 0 top
L6  DLP11SN900HL2L  [0504-DLP11S]  22.65,35.3 0 top
L7  DLP11SN900HL2L  [0504-DLP11S]  113.75,46.25 90 top
L8  DLP11SN900HL2L  [0504-DLP11S]  105.35,59.9 180 top
L9  DLP11SN900HL2L  [0504-DLP11S]  105.35,58.35 180 top
L10  DLP11SN900HL2L  [0504-DLP11S]  18,54.55 90 top
L11  DLP11SN900HL2L  [0504-DLP11S]  18,47.35 270 top
L12  DLP11SN900HL2L  [0504-DLP11S]  105.35,63 180 top
L13  DLP11SN900HL2L  [0504-DLP11S]  105.35,61.45 180 top
L14  IHLP3232DZER100M11  [3232DZ]  89,72.5 180 top
L15  LQH44PN6R8MP0L  [1515]  87.5,84.9 270 top
L16  DLP11SN900HL2L  [0504-DLP11S]  9,26.45 270 bottom
L17  DLP11SN900HL2L  [0504-DLP11S]  9,37.15 90 bottom
L18  DLP11SN900HL2L  [0504-DLP11S]  10,32.3 0 bottom
L19  DLP11SN900HL2L  [0504-DLP11S]  30.5,10.85 90 top
L20  DLP11SN900HL2L  [0504-DLP11S]  33.5,10.85 90 top
L21  DLP11SN900HL2L  [0504-DLP11S]  27.5,10.85 90 top
L22  DLP11SN900HL2L  [0504-DLP11S]  53.5,10.85 90 top
MP1  9774015151R  [WA-SMSI_9774___151]  28.5,51 0 top
MP2  9774015151R  [WA-SMSI_9774___151]  28.5,84 0 top
MP3  9774015151R  [WA-SMSI_9774___151]  76.5,51 0 top
MP4  9774015151R  [WA-SMSI_9774___151]  76.5,84 0 top
Q1  BSS138  [SOT23]  38.9,80.85 0 bottom
Q2  FDN360P  [SOT23]  40,84.25 90 bottom
Q3  FDN360P  [SOT23]  36.5,84.1 180 bottom
Q4  BSS138  [SOT23]  95.05,48 90 bottom
Q5  BSS138  [SOT23]  89.55,48 90 bottom
R1  RC0201FR-0710KL  [0201]  13.35,16.22 180 bottom
R2  ERJ-1GNJ151C  [0201]  11.66,16.11 0 bottom
R3  RC0201JR-070RL  [0201]  77.1,22.2 270 bottom
R4  ERJ-1GEF1202C  [0201]  53.45,38.25 270 bottom
R5  RC0201FR-07100KL  [0201]  47.1,40.5 180 bottom
R6  RC0201FR-07100KL  [0201]  46.9,39.65 180 bottom
R7  RC0201FR-07100KL  [0201]  49.55,37.65 0 bottom
R8  RC0201FR-07100KL  [0201]  47.85,42.45 270 bottom
R9  DNP  [0201]  83.35,22.55 0 top
R10  ERJ-1GEJ204C  [0201]  83.35,21.55 180 top
R11  ERJ-1GEJ204C  [0201]  81.9,21.55 180 top
R12  RC0201FR-07100KL  [0201]  60.35,21.5 180 bottom
R13  1M0  [0201]  84.2,29.45 90 top
R14  RC0201FR-0710KL  [0201]  83.3,23.55 0 top
R15  RC0201FR-0710KL  [0201]  80.35,21.95 270 top
R16  ERJ-1GEF1202C  [0201]  84.1,31.5 180 top
R17  ERJ-2RKF3162X  [0402]  60.35,20.25 0 bottom
R18  CR0805-J/-000ELF  [0805]  93.4,67.4 90 bottom
R19  RC1005J000CS  [0402]  85.8,84.25 0 bottom
R20  1M0  [0201]  85.8,85.15 0 bottom
R21  RC0201JR-070RL  [0201]  85.25,80.6 270 top
R22  DNP  [0402]  86.7,81.7 0 bottom
R23  ERJ-1GEF49R9C  [0201]  21.8,69.7 90 top
R24  ERJ-1GEJ331C  [0201]  5.93,76.25 90 bottom
R25  ERJ-1GEJ331C  [0201]  5.93,66.64 270 bottom
R26  P1.0KAGTR-ND  [0201]  96.55,46.9 0 bottom
R27  RC0201FR-0710KL  [0201]  107.25,22.45 180 top
R28  RC0201FR-07100KL  [0201]  97.19,47.13 270 top
R29  ERJ-2RKF3000X  [0402]  89.35,49.2 0 top
R30  RC0201FR-07100KL  [0201]  91.69,47.13 270 top
R31  RC0201JR-070RL  [0201]  114.05,42.6 90 top
R32  RC0201FR-0712K1L  [0201]  102.15,25.75 90 top
R33  ERJ-1GEF49R9C  [0201]  21.8,76.01 270 top
R34  ERJ-1GEF49R9C  [0201]  21.8,74.67 90 top
R35  ERJ-1GEF49R9C  [0201]  21.8,73.3 270 top
R36  ERJ-1GEF49R9C  [0201]  21.8,68.35 270 top
R37  ERJ-1GEF49R9C  [0201]  21.8,67 90 top
R38  RC0201FR-0710KL  [0201]  40.1,42.25 270 top
R39  RC0201JR-070RL  [0201]  36.15,42.1 180 top
R40  P1.0KAGTR-ND  [0201]  91.05,46.9 0 bottom
R41  ERJ-1GNF10R0C  [0201]  13.58,70.35 90 bottom
R42  ERJ-1GEF49R9C  [0201]  21.8,77.37 90 top
R43  CRCW040275R0FKEDC  [0402]  111.45,58.6 90 bottom
R44  RC0201JR-070RL  [0201]  43.4,81 270 bottom
R45  ERJ-2RKF3000X  [0402]  94.85,49.2 0 top
R47  RC0201FR-07100KL  [0201]  101.65,21.35 270 top
R48  DNP  [0201]  42.55,81 270 bottom
R49  RC0201JR-070RL  [0201]  35.5,82.5 90 bottom
R50  RC0201JR-070RL  [0201]  41.6,80.7 270 top
R51  RC0201FR-0710KL  [0201]  39.55,78.5 180 bottom
R52  RC0201FR-07100KL  [0201]  60.5,79.5 0 bottom
R53  RC0201FR-07100KL  [0201]  60.5,80.3 0 bottom
R54  RC0201FR-07100KL  [0201]  60.5,81.1 0 bottom
R55  RC0201FR-0710KL  [0201]  113.05,30.7 0 top
R56  ERJ-1GNJ152C  [0201]  51,78.9 0 bottom
R57  ERJ-1GNJ152C  [0201]  51,79.7 0 bottom
R58  ERJ-1GEF49R9C  [0201]  21.8,65.63 270 top
R59  RC0201FR-07100KL  [0201]  85.5,61.65 270 bottom
R60  RC0201JR-070RL  [0201]  56.6,39.2 0 bottom
R61  ERJ-2RKF3162X  [0402]  84.25,61.65 90 bottom
R62  1M0  [0201]  51.7,36.45 0 top
R63  RC0201FR-07100KL  [0201]  47.35,38 0 top
R64  RC0201FR-07100KL  [0201]  46.15,39.3 90 top
R65  RC0201JR-070RL  [0201]  80.8,24.05 270 bottom
R66  ERJ-1GNF10R0C  [0201]  85.65,29.9 180 top
R67  DNP  [0201]  81.9,20.55 0 top
R68  CR0805-J/-000ELF  [0805]  54.6,29.4 0 bottom
R69  RC0201JR-070RL  [0201]  79.9,22.4 270 bottom
R70  RC0201FR-0710KL  [0201]  0.88,16.7 90 bottom
R71  ERJ-1GNJ151C  [0201]  2.04,16.14 180 bottom
RP1  DNP  [RP741X083]  39.05,42.1 270 bottom
RP2  DNP  [RP741X083]  36.7,42.05 90 bottom
RP3  DNP  [741X08]  103.7,53.25 90 bottom
S1  EVQ-PLDA15  [EVQ]  11.75,16.75 90 top
S2  EVQ-P7C01P  [EVQP-4]  1.75,15 270 top
TP1  DNP  [TP0500]  55.55,29.85 90 top
TP2  DNP  [TP0500]  93.85,66.45 0 top
U1  TPS5450QDDARQ1  [8SO_POWERPAD]  58.7,25 0 bottom
U2  TPD4E02B04DQAR  [UFDFN-10]  20.1,32.3 90 bottom
U3  TPD4E02B04DQAR  [UFDFN-10]  48.25,9.35 0 bottom
U4  TPD4E02B04DQAR  [UFDFN-10]  52.75,9.35 0 bottom
U5  TPD4E02B04DQAR  [UFDFN-10]  12.25,29.3 90 bottom
U6  TPD4E02B04DQAR  [UFDFN-10]  12.25,35.25 270 bottom
U7  TPD4E02B04DQAR  [UFDFN-10]  12.25,32.3 270 bottom
U8  TPD4E02B04DQAR  [UFDFN-10]  23.7,75.35 270 top
U9  TPD13S523PWR  [TSSOP16]  106,60.8 0 bottom
U10  ASM1142  [QFN64-9X9MM-FT2232HQ]  107.45,27.75 90 top
U11  TPS2052BDGNR  [MSOP8-PAD]  1.65,49.15 180 bottom
U12  67996-140HLF  [2X20]  86.5,2.6 0 top
U13  USB2513B-AEZG  [QFN36-6X6MM]  51.5,41 180 top
U14  685119134923  [47151-001]  110.1,59 90 top
U15  USB5744/2G  [VQFN56]  79.75,27.75 270 top
U16  TPD4E02B04DQAR  [UFDFN-10]  23.7,67.65 270 top
U17  TPS5450QDDARQ1  [8SO_POWERPAD]  89,63.3 90 bottom
U18  ADP1740ACPZ-1.2-R7  [LFCSPWQ16]  99,22.95 90 top
U19  TS3A5223RSWR  [UQFN-10]  37.95,42.1 270 top
U20  TPD4E02B04DQAR  [UFDFN-10]  20.1,36.05 90 bottom
U21  TPD4E02B04DQAR  [UFDFN-10]  20.1,28.55 90 bottom
U22  TPD4E02B04DQAR  [UFDFN-10]  28.25,9.35 0 bottom
U23  TPD4E02B04DQAR  [UFDFN-10]  32.75,9.35 0 bottom
U24  TPS2066CDGNR  [MSOP8-PAD]  1.65,30.45 180 bottom
U$11  DNP  [GEPPETTO_HOLE_2.9]  116,85.5 0 top
U$13  DNP  [GEPPETTO_HOLE_2.9]  3,85.5 0 top
U$17  DNP  [GEPPETTO_HOLE_2.9]  3,5.5 0 top
U$24  TXS0104ERGYR  [S-PVQFN-N14]  103.75,53.7 270 top
U$28  DNP  [GEPPETTO_HOLE_2.9]  116,5.5 0 top
Y1  ABM8G-24.000MHZ-18-D2Y-T  [CRYSTAL-3225]  50.9,35.15 180 bottom
Y2  ABM7-25.000MHZ-D2Y-T  [CS10]  86.55,26.55 90 bottom
Y3  ABM8G-20.000MHZ-18-D2Y-T  [CRYSTAL-3225]  100.2,32.45 90 top